# Altium schematic sheet Extension.SCHDOC: Evaluation Board 3.2
size A3; Organization: Toradex AG; Address1: Altsagenstrasse 5; Address2: Horw; Address3: 6048; Address4: Switzerland; DocumentNumber: 22; Revision: V3.2; SheetNumber: 22; SheetTotal: 23; PageSetup: Record=PageOptions|CenterHorizontal=True|CenterVertical=True|PrintScale=0.73|XCorrection=1.00|YCorrection=1.00|PrintKind=0|BorderSize=5000000|LeftOffset=0|BottomOffset=0|Orientation=2|PaperLength=1000|PaperWidth=1000|Scale=100|PaperSource=7|PrintQuality=-4|MediaType=1|DitherType=10|PaperKind=A4|PrintScaleMode=1
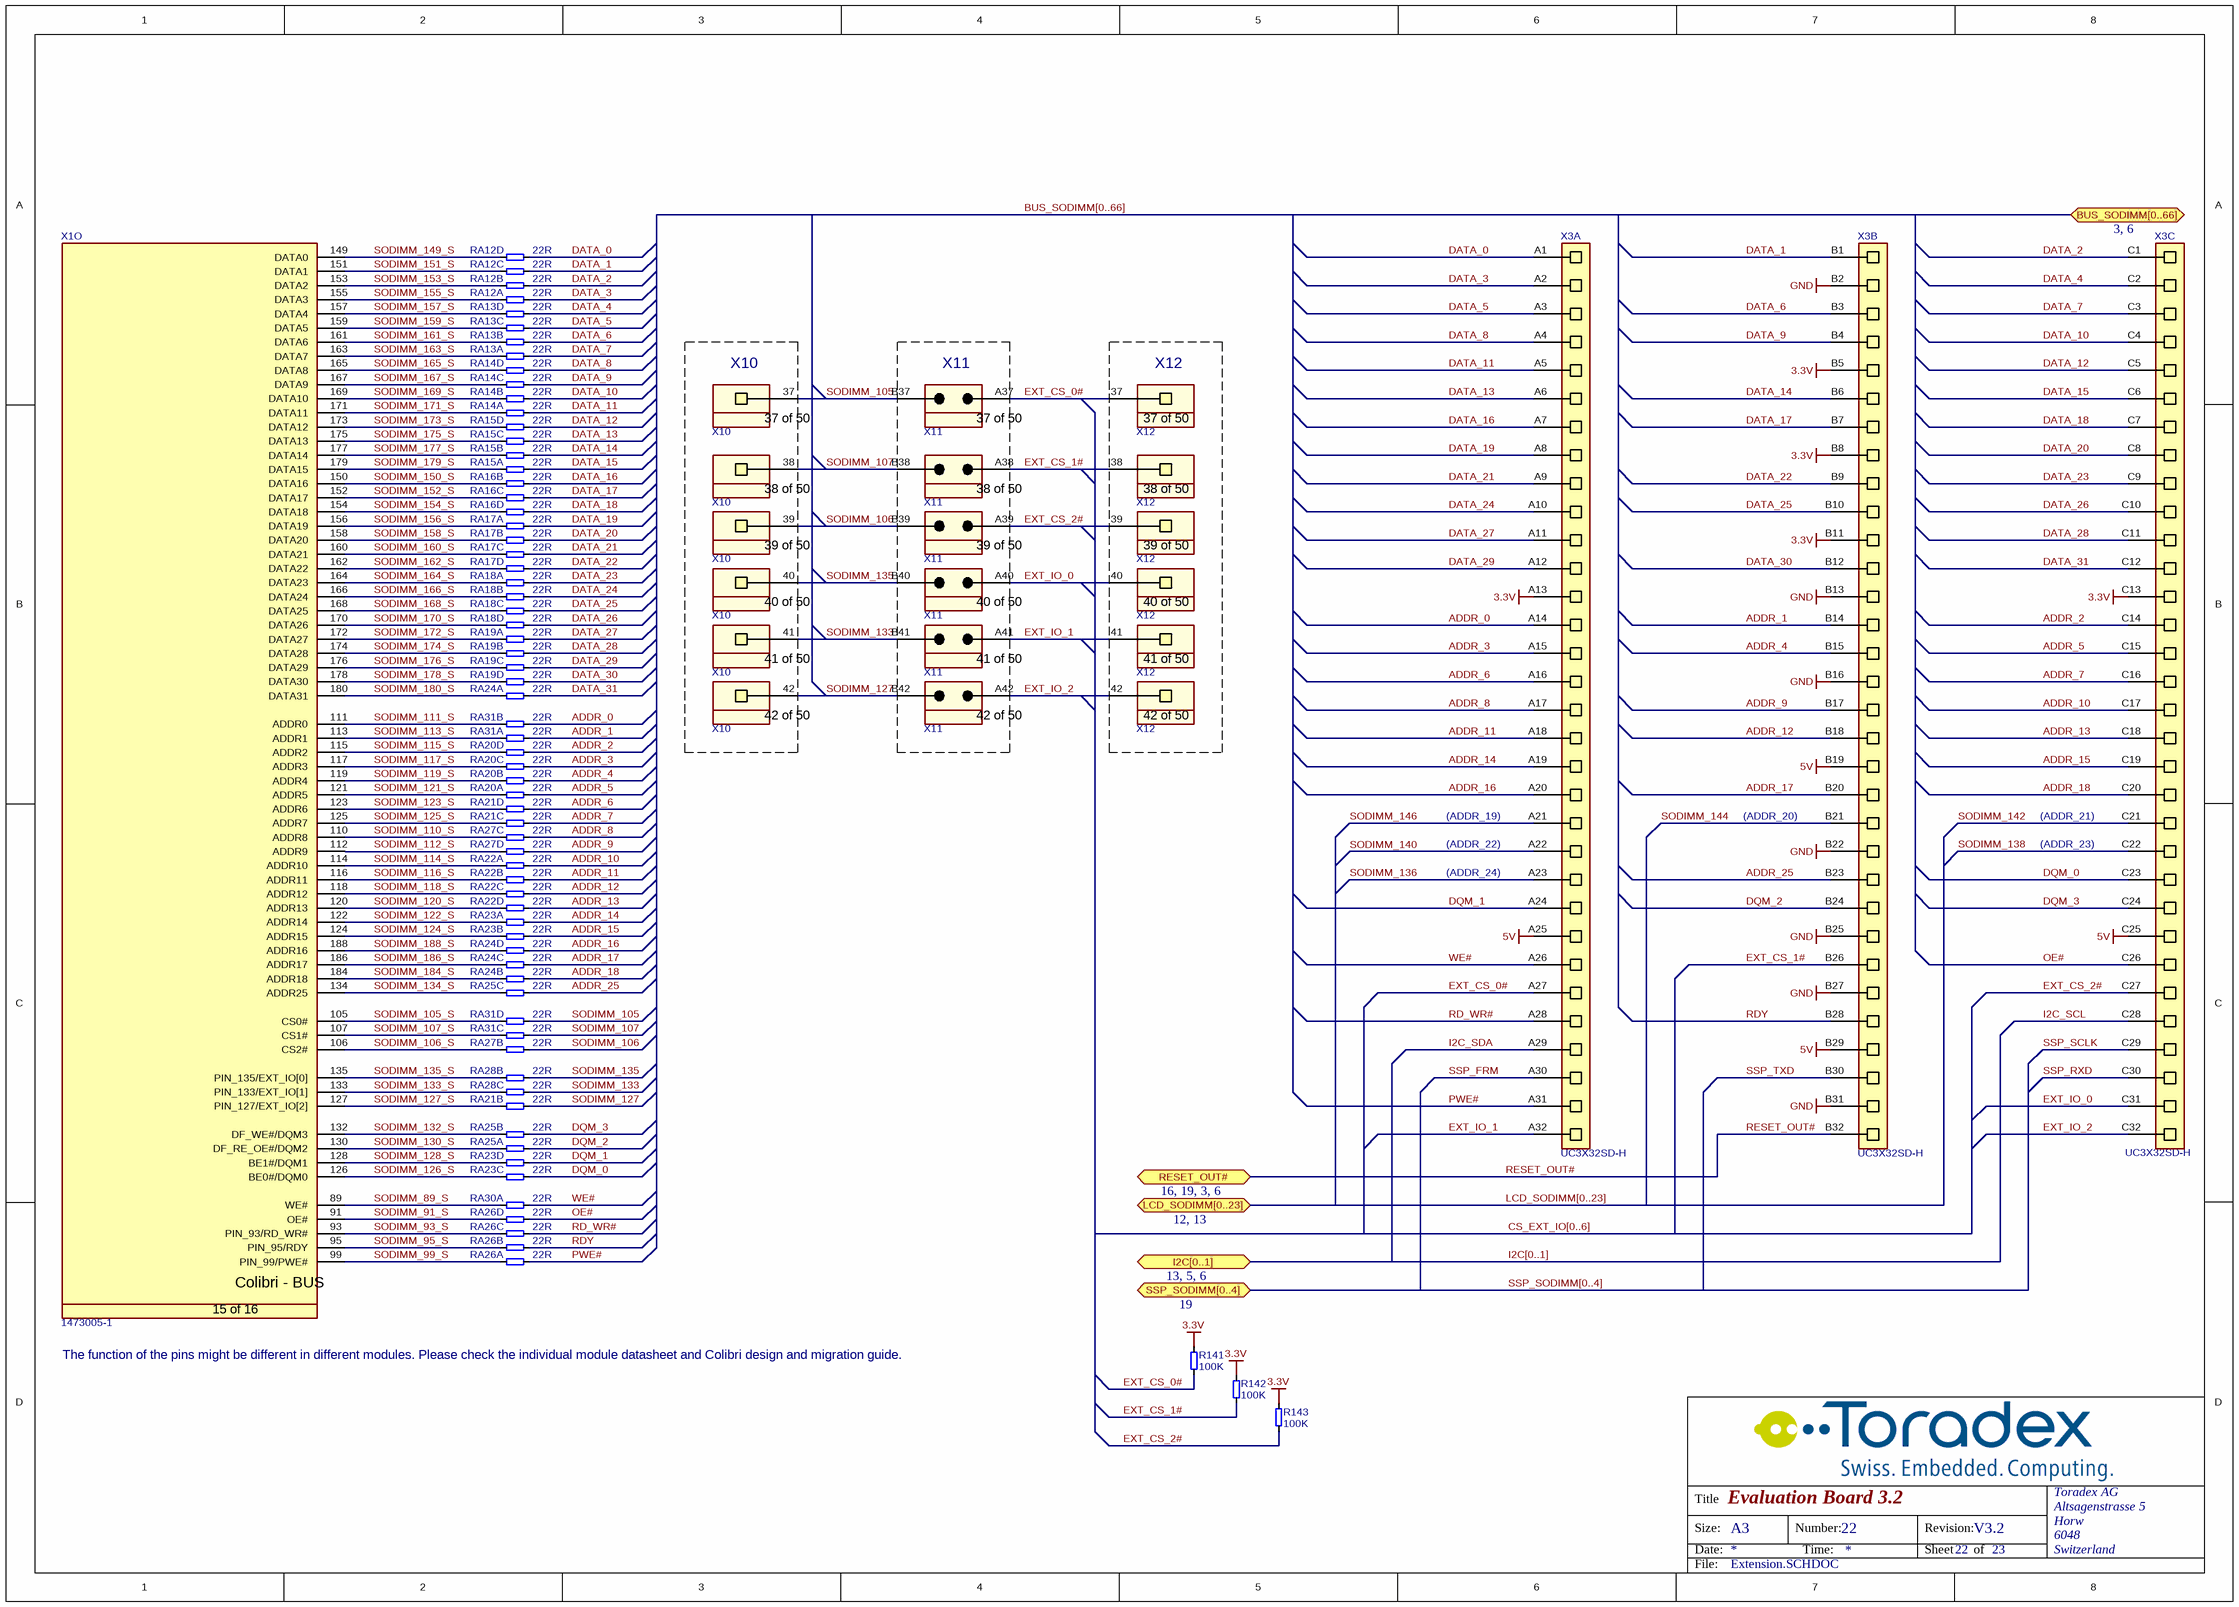
[diagram p0: Extension.SCHDOC]

## Parts
R141  100K  [T_RESC0603X30N]
R142  100K  [T_RESC0603X30N]
R143  100K  [T_RESC0603X30N]
RA12  22R  [T_Resistor_Array_X4]  (parts A,B,C,D of 4)
RA13  22R  [T_Resistor_Array_X4]  (parts A,B,C,D of 4)
RA14  22R  [T_Resistor_Array_X4]  (parts A,B,C,D of 4)
RA15  22R  [T_Resistor_Array_X4]  (parts A,B,C,D of 4)
RA16  22R  [T_Resistor_Array_X4]  (parts B,C,D of 4)
RA17  22R  [T_Resistor_Array_X4]  (parts A,B,C,D of 4)
RA18  22R  [T_Resistor_Array_X4]  (parts A,B,C,D of 4)
RA19  22R  [T_Resistor_Array_X4]  (parts A,B,C,D of 4)
RA20  22R  [T_Resistor_Array_X4]  (parts A,B,C,D of 4)
RA21  22R  [T_Resistor_Array_X4]  (parts B,C,D of 4)
RA22  22R  [T_Resistor_Array_X4]  (parts A,B,C,D of 4)
RA23  22R  [T_Resistor_Array_X4]  (parts A,B,C,D of 4)
RA24  22R  [T_Resistor_Array_X4]  (parts A,B,C,D of 4)
RA25  22R  [T_Resistor_Array_X4]  (parts A,B,C of 4)
RA26  22R  [T_Resistor_Array_X4]  (parts A,B,C,D of 4)
RA27  22R  [T_Resistor_Array_X4]  (parts B,C,D of 4)
RA28  22R  [T_Resistor_Array_X4]  (parts B,C of 4)
RA30  22R  [T_Resistor_Array_X4]  (part A of 4)
RA31  22R  [T_Resistor_Array_X4]  (parts A,B,C,D of 4)
X1  Manufacturer Part No.: 1473005-1  [T_Tyco_1473005-1]  (hidden comment: CON-Tyco-1473005-1-200-0.6mm)  (part O of 16)
X3  UC3X32SD-H  [T_AUK_UC3X32SD-H]  (parts A,B,C of 3)
X10  SSW-110-01-G-S  [T_Samtec_SSW-110-01-G-S]  (value not drawn)  (parts 37,38,39,40,41,42 of 50)
X11  TSW-110-07-G-D  [T_Samtec_TSW-110-07-G-D]  (value not drawn)  (parts 37,38,39,40,41,42 of 50)
X12  SSW-110-01-G-S  [T_Samtec_SSW-110-01-G-S]  (value not drawn)  (parts 37,38,39,40,41,42 of 50)

## Blocks framed on the sheet
X10: X10
X11: X11
X12: X12

## Ports
BUS_SODIMM[0..66] (bidir, see 3, 6), I2C[0..1] (bidir, see 13, 5, 6), LCD_SODIMM[0..23] (bidir, see 12, 13), RESET_OUT# (bidir, see 16, 19, 3, 6), SSP_SODIMM[0..4] (bidir, see 19)

## Nets
3.3V: R141.2 R142.2 R143.2 X3.A13 X3.B5 X3.B8 X3.B11 X3.C13
5V: X3.A25 X3.B19 X3.B29 X3.C25
GND: X3.B2 X3.B13 X3.B16 X3.B22 X3.B25 X3.B27 X3.B31
ADDR_0: RA31.6 X3.A14
ADDR_1: RA31.5 X3.B14
ADDR_2: RA20.8 X3.C14
ADDR_3: RA20.7 X3.A15
ADDR_4: RA20.6 X3.B15
ADDR_5: RA20.5 X3.C15
ADDR_6: RA21.8 X3.A16
ADDR_7: RA21.7 X3.C16
ADDR_8: RA27.7 X3.A17
ADDR_9: RA27.8 X3.B17
ADDR_10: RA22.5 X3.C17
ADDR_11: RA22.6 X3.A18
ADDR_12: RA22.7 X3.B18
ADDR_13: RA22.8 X3.C18
ADDR_14: RA23.5 X3.A19
ADDR_15: RA23.6 X3.C19
ADDR_16: RA24.8 X3.A20
ADDR_17: RA24.7 X3.B20
ADDR_18: RA24.6 X3.C20
ADDR_25: RA25.7 X3.B23
DATA_0: RA12.8 X3.A1
DATA_1: RA12.7 X3.B1
DATA_2: RA12.6 X3.C1
DATA_3: RA12.5 X3.A2
DATA_4: RA13.8 X3.C2
DATA_5: RA13.7 X3.A3
DATA_6: RA13.6 X3.B3
DATA_7: RA13.5 X3.C3
DATA_8: RA14.8 X3.A4
DATA_9: RA14.7 X3.B4
DATA_10: RA14.6 X3.C4
DATA_11: RA14.5 X3.A5
DATA_12: RA15.8 X3.C5
DATA_13: RA15.7 X3.A6
DATA_14: RA15.6 X3.B6
DATA_15: RA15.5 X3.C6
DATA_16: RA16.6 X3.A7
DATA_17: RA16.7 X3.B7
DATA_18: RA16.8 X3.C7
DATA_19: RA17.5 X3.A8
DATA_20: RA17.6 X3.C8
DATA_21: RA17.7 X3.A9
DATA_22: RA17.8 X3.B9
DATA_23: RA18.5 X3.C9
DATA_24: RA18.6 X3.A10
DATA_25: RA18.7 X3.B10
DATA_26: RA18.8 X3.C10
DATA_27: RA19.5 X3.A11
DATA_28: RA19.6 X3.C11
DATA_29: RA19.7 X3.A12
DATA_30: RA19.8 X3.B12
DATA_31: RA24.5 X3.C12
DQM_0: RA23.7 X3.C23
DQM_1: RA23.8 X3.A24
DQM_2: RA25.5 X3.B24
DQM_3: RA25.6 X3.C24
EXT_CS_0#: R141.1 X3.A27 X11.A37 X12.37
EXT_CS_1#: R142.1 X3.B26 X11.A38 X12.38
EXT_CS_2#: R143.1 X3.C27 X11.A39 X12.39
EXT_IO_0: X3.C31 X11.A40 X12.40
EXT_IO_1: X3.A32 X11.A41 X12.41
EXT_IO_2: X3.C32 X11.A42 X12.42
I2C_SCL: X3.C28
I2C_SDA: X3.A29
OE#: RA26.8 X3.C26
PWE#: RA26.5 X3.A31
RD_WR#: RA26.7 X3.A28
RDY: RA26.6 X3.B28
RESET_OUT#: X3.B32 ; port RESET_OUT#
SODIMM_89_S: RA30.1 X1.89(WE#)
SODIMM_91_S: RA26.4 X1.91(OE#)
SODIMM_93_S: RA26.3 X1.93(PIN_93/RD_WR#)
SODIMM_95_S: RA26.2 X1.95(PIN_95/RDY)
SODIMM_99_S: RA26.1 X1.99(PIN_99/PWE#)
SODIMM_105: RA31.8 X10.37 X11.B37
SODIMM_105_S: RA31.4 X1.105(CS0#)
SODIMM_106: RA27.6 X10.39 X11.B39
SODIMM_106_S: RA27.2 X1.106(CS2#)
SODIMM_107: RA31.7 X10.38 X11.B38
SODIMM_107_S: RA31.3 X1.107(CS1#)
SODIMM_110_S: RA27.3 X1.110(ADDR8)
SODIMM_111_S: RA31.2 X1.111(ADDR0)
SODIMM_112_S: RA27.4 X1.112(ADDR9)
SODIMM_113_S: RA31.1 X1.113(ADDR1)
SODIMM_114_S: RA22.1 X1.114(ADDR10)
SODIMM_115_S: RA20.4 X1.115(ADDR2)
SODIMM_116_S: RA22.2 X1.116(ADDR11)
SODIMM_117_S: RA20.3 X1.117(ADDR3)
SODIMM_118_S: RA22.3 X1.118(ADDR12)
SODIMM_119_S: RA20.2 X1.119(ADDR4)
SODIMM_120_S: RA22.4 X1.120(ADDR13)
SODIMM_121_S: RA20.1 X1.121(ADDR5)
SODIMM_122_S: RA23.1 X1.122(ADDR14)
SODIMM_123_S: RA21.4 X1.123(ADDR6)
SODIMM_124_S: RA23.2 X1.124(ADDR15)
SODIMM_125_S: RA21.3 X1.125(ADDR7)
SODIMM_126_S: RA23.3 X1.126(BE0#/DQM0)
SODIMM_127: RA21.6 X10.42 X11.B42
SODIMM_127_S: RA21.2 X1.127(PIN_127/EXT_IO[2])
SODIMM_128_S: RA23.4 X1.128(BE1#/DQM1)
SODIMM_130_S: RA25.1 X1.130(DF_RE_OE#/DQM2)
SODIMM_132_S: RA25.2 X1.132(DF_WE#/DQM3)
SODIMM_133: RA28.7 X10.41 X11.B41
SODIMM_133_S: RA28.3 X1.133(PIN_133/EXT_IO[1])
SODIMM_134_S: RA25.3 X1.134(ADDR25)
SODIMM_135: RA28.6 X10.40 X11.B40
SODIMM_135_S: RA28.2 X1.135(PIN_135/EXT_IO[0])
SODIMM_136: X3.A23
SODIMM_138: X3.C22
SODIMM_140: X3.A22
SODIMM_142: X3.C21
SODIMM_144: X3.B21
SODIMM_146: X3.A21
SODIMM_149_S: RA12.4 X1.149(DATA0)
SODIMM_150_S: RA16.2 X1.150(DATA16)
SODIMM_151_S: RA12.3 X1.151(DATA1)
SODIMM_152_S: RA16.3 X1.152(DATA17)
SODIMM_153_S: RA12.2 X1.153(DATA2)
SODIMM_154_S: RA16.4 X1.154(DATA18)
SODIMM_155_S: RA12.1 X1.155(DATA3)
SODIMM_156_S: RA17.1 X1.156(DATA19)
SODIMM_157_S: RA13.4 X1.157(DATA4)
SODIMM_158_S: RA17.2 X1.158(DATA20)
SODIMM_159_S: RA13.3 X1.159(DATA5)
SODIMM_160_S: RA17.3 X1.160(DATA21)
SODIMM_161_S: RA13.2 X1.161(DATA6)
SODIMM_162_S: RA17.4 X1.162(DATA22)
SODIMM_163_S: RA13.1 X1.163(DATA7)
SODIMM_164_S: RA18.1 X1.164(DATA23)
SODIMM_165_S: RA14.4 X1.165(DATA8)
SODIMM_166_S: RA18.2 X1.166(DATA24)
SODIMM_167_S: RA14.3 X1.167(DATA9)
SODIMM_168_S: RA18.3 X1.168(DATA25)
SODIMM_169_S: RA14.2 X1.169(DATA10)
SODIMM_170_S: RA18.4 X1.170(DATA26)
SODIMM_171_S: RA14.1 X1.171(DATA11)
SODIMM_172_S: RA19.1 X1.172(DATA27)
SODIMM_173_S: RA15.4 X1.173(DATA12)
SODIMM_174_S: RA19.2 X1.174(DATA28)
SODIMM_175_S: RA15.3 X1.175(DATA13)
SODIMM_176_S: RA19.3 X1.176(DATA29)
SODIMM_177_S: RA15.2 X1.177(DATA14)
SODIMM_178_S: RA19.4 X1.178(DATA30)
SODIMM_179_S: RA15.1 X1.179(DATA15)
SODIMM_180_S: RA24.1 X1.180(DATA31)
SODIMM_184_S: RA24.2 X1.184(ADDR18)
SODIMM_186_S: RA24.3 X1.186(ADDR17)
SODIMM_188_S: RA24.4 X1.188(ADDR16)
SSP_FRM: X3.A30
SSP_RXD: X3.C30
SSP_SCLK: X3.C29
SSP_TXD: X3.B30
WE#: RA30.5 X3.A26

## Buses and harness runs
bus BUS_SODIMM[0..66] = port BUS_SODIMM[0..66]
bus CS_EXT_IO[0..6]
bus I2C[0..1] = port I2C[0..1]
bus LCD_SODIMM[0..23] = port LCD_SODIMM[0..23]
bus SSP_SODIMM[0..4] = port SSP_SODIMM[0..4]

## Notes on the sheet
- (ADDR_19)
- (ADDR_20)
- (ADDR_21)
- (ADDR_22)
- (ADDR_24)
- (ADDR_23)
- The function of the pins might be different in different modules. Please check the individual module datasheet and Colibri design and migration guide.
- Title
- Size:
- Date:
- A3
- Number:
- Time:
- Revision:
- Sheet
- of
- File:
- (in symbol CON-Samtec-SSW-110-01-G-S, part 37) 37 of 50
- (in symbol CON-Samtec-SSW-110-01-G-S, part 38) 38 of 50
- (in symbol CON-Samtec-SSW-110-01-G-S, part 39) 39 of 50
- (in symbol CON-Samtec-SSW-110-01-G-S, part 40) 40 of 50
- (in symbol CON-Samtec-SSW-110-01-G-S, part 41) 41 of 50
- (in symbol CON-Samtec-SSW-110-01-G-S, part 42) 42 of 50
- (in symbol CON-Samtec-TSW-110-07-G-D, part 37) 37 of 50
- (in symbol CON-Samtec-TSW-110-07-G-D, part 38) 38 of 50
- (in symbol CON-Samtec-TSW-110-07-G-D, part 39) 39 of 50
- (in symbol CON-Samtec-TSW-110-07-G-D, part 40) 40 of 50
- (in symbol CON-Samtec-TSW-110-07-G-D, part 41) 41 of 50
- (in symbol CON-Samtec-TSW-110-07-G-D, part 42) 42 of 50
- (in symbol CON-Tyco-1473005-1-200-0.6mm, part O) Colibri - BUS; 15 of 16

## Library data of the parts
R141-R143 = R-100KR-63mW-5%-0603: Resistor 100 Kohm 63mW 5% 0603; Value: 100KR; Rating: 63mW; Tolerance: 5%
RA12-RA28 RA30 RA31 = RA-22R-63mW-5%-1206-div: Resistor Array 22 R 63mW 5% 1206; Tolerance: 5%; Power Dissipation: 63mW; Value: 22R
X1 = CON-Tyco-1473005-1-200-0.6mm: SODIMM Connector; Manufacturer Name: Tyco; No. of ways: 200
X3 = CON-Auk-UC3X32SD-H: Header Female 3x32 pin 2.54mm; Manufacturer Name: Auk; Pitch: 2.54mm; No. of ways: 3x32; Manufacturer Part No.: UC3X32SD-H
X10 X12 = CON-Samtec-SSW-110-01-G-S: Header 1x50 pin 2.54mm pitch; Manufacturer Name: Samtec; Pitch: 2.54mm; No. of ways: 1x50; Manufacturer Part No.: SSW-110-01-G-S
X11 = CON-Samtec-TSW-110-07-G-D: Header 2x50 pin 2.54mm pitch; Manufacturer Name: Samtec; Pitch: 2.54mm; No. of ways: 2x50; Manufacturer Part No.: TSW-110-07-G-D